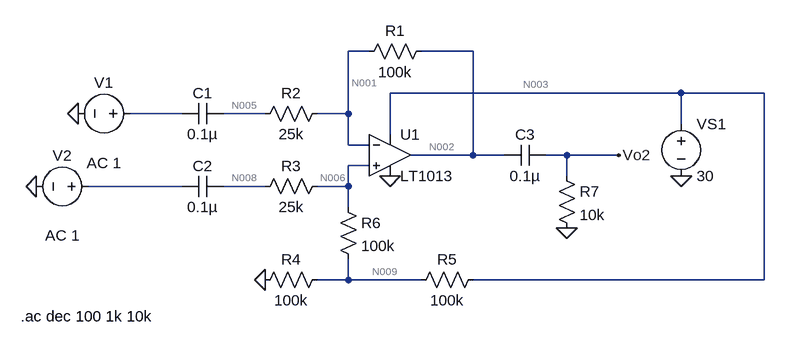
[diagram p0: schematic Q2.asc]
Q2.asc, the LTspice schematic file:
Version 4
SHEET 1 880 680
WIRE -672 -176 -704 -176
WIRE -512 -176 -592 -176
WIRE -192 -112 -640 -112
WIRE -64 -112 -192 -112
WIRE -960 -80 -1040 -80
WIRE -832 -80 -896 -80
WIRE -704 -80 -704 -176
WIRE -704 -80 -752 -80
WIRE -192 -64 -192 -112
WIRE -640 -48 -640 -112
WIRE -704 -32 -704 -80
WIRE -672 -32 -704 -32
WIRE -512 -16 -512 -176
WIRE -512 -16 -608 -16
WIRE -464 -16 -512 -16
WIRE -368 -16 -400 -16
WIRE -288 -16 -368 -16
WIRE -672 0 -704 0
WIRE -368 16 -368 -16
WIRE -960 32 -1104 32
WIRE -832 32 -896 32
WIRE -704 32 -704 0
WIRE -704 32 -752 32
WIRE -704 64 -704 32
WIRE -704 176 -704 144
WIRE -704 176 -752 176
WIRE -592 176 -704 176
WIRE -64 176 -64 -112
WIRE -64 176 -512 176
FLAG -192 16 0
FLAG -832 176 0
FLAG -1184 32 0
FLAG -1120 -80 0
FLAG -288 -16 Vo2
FLAG -368 96 0
FLAG -640 16 0
SYMBOL Opamps\\LT1013 -640 -80 R0
SYMATTR InstName U1
SYMBOL res -688 -160 R270
WINDOW 0 32 56 VTop 2
WINDOW 3 0 56 VBottom 2
SYMATTR InstName R1
SYMATTR Value 100k
SYMBOL res -848 -64 R270
WINDOW 0 32 56 VTop 2
WINDOW 3 0 56 VBottom 2
SYMATTR InstName R2
SYMATTR Value 25k
SYMBOL res -848 48 R270
WINDOW 0 32 56 VTop 2
WINDOW 3 0 56 VBottom 2
SYMATTR InstName R3
SYMATTR Value 25k
SYMBOL res -848 192 R270
WINDOW 0 32 56 VTop 2
WINDOW 3 0 56 VBottom 2
SYMATTR InstName R4
SYMATTR Value 100k
SYMBOL res -608 192 R270
WINDOW 0 32 56 VTop 2
WINDOW 3 0 56 VBottom 2
SYMATTR InstName R5
SYMATTR Value 100k
SYMBOL res -720 48 R0
SYMATTR InstName R6
SYMATTR Value 100k
SYMBOL res -384 0 R0
SYMATTR InstName R7
SYMATTR Value 10k
SYMBOL voltage -192 -80 R0
SYMATTR InstName VS1
SYMATTR Value 30
SYMBOL voltage -1024 -80 R90
WINDOW 0 -32 56 VBottom 2
WINDOW 3 32 56 VTop 2
WINDOW 123 60 56 VTop 2
WINDOW 39 0 0 Left 2
SYMATTR InstName V1
SYMATTR Value ""
SYMATTR Value2 AC 1
SYMBOL voltage -1088 32 R90
WINDOW 0 -32 56 VBottom 2
WINDOW 3 32 56 VTop 2
WINDOW 123 60 56 VTop 2
WINDOW 39 0 0 Left 2
SYMATTR InstName V2
SYMATTR Value ""
SYMATTR Value2 AC 1
SYMBOL cap -896 -96 R90
WINDOW 0 0 32 VBottom 2
WINDOW 3 32 32 VTop 2
SYMATTR InstName C1
SYMATTR Value 0.1µ
SYMBOL cap -896 16 R90
WINDOW 0 0 32 VBottom 2
WINDOW 3 32 32 VTop 2
SYMATTR InstName C2
SYMATTR Value 0.1µ
SYMBOL cap -400 -32 R90
WINDOW 0 0 32 VBottom 2
WINDOW 3 32 32 VTop 2
SYMATTR InstName C3
SYMATTR Value 0.1µ
TEXT -1208 232 Left 2 !.ac dec 100 1k 10k

The netlist it stands for:
* Q2.asc
XU1 N006 N001 N003 0 N002 LT1013  ; pins In+ In- V+ V- OUT
R1 N001 N002 100k
R2 N005 N001 25k
R3 N008 N006 25k
R4 0 N009 100k
R5 N009 N003 100k
R6 N006 N009 100k
R7 Vo2 0 10k
VS1 N003 0 30
V1 N004 0 AC 1
V2 N007 0 AC 1
C1 N005 N004 0.1µ
C2 N008 N007 0.1µ
C3 Vo2 N002 0.1µ
.ac dec 100 1k 10k
.lib LTC.lib
.backanno
.end

* Results of the author's LTspice run, read from the files saved beside the schematic
* Operating Point, zero values left out:
*   V(n001) = 15 V
*   V(n006) = 15 V
*   V(n003) = 30 V
*   V(n002) = 15 V
*   V(n005) = 15 V
*   V(n008) = 15 V
*   V(n009) = 15 V
*   I(R6) = 12.02 nA
*   I(R5) = -150 µA
*   I(R4) = -150 µA
*   I(R1) = 12.02 nA
*   I(Vs1) = -500 µA
*   Ix(u1:1) = -12.02 nA
*   Ix(u1:2) = -12.02 nA
*   Ix(u1:3) = 350 µA
*   Ix(u1:4) = -350 µA
*   Ix(u1:5) = 12.02 nA
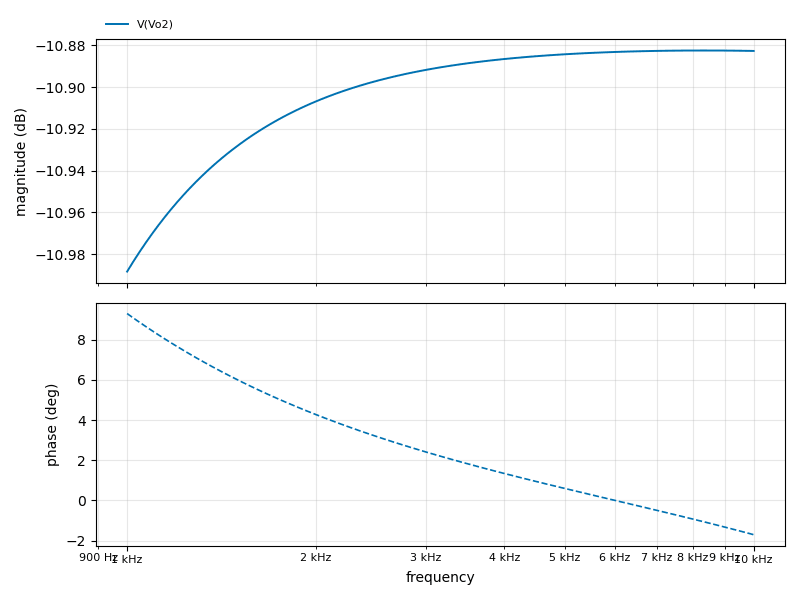
[diagram p1: AC Analysis of Q2.asc, plotted from the saved traces]
* AC Analysis, 1 run:
*   V(Vo2): -10.99 dB at 1 kHz, -10.88 dB at 10 kHz, peak -10.88 dB at 8.318 kHz